# EAGLE schematic prototipo 1 v30 (EAGLE 9.7.0)
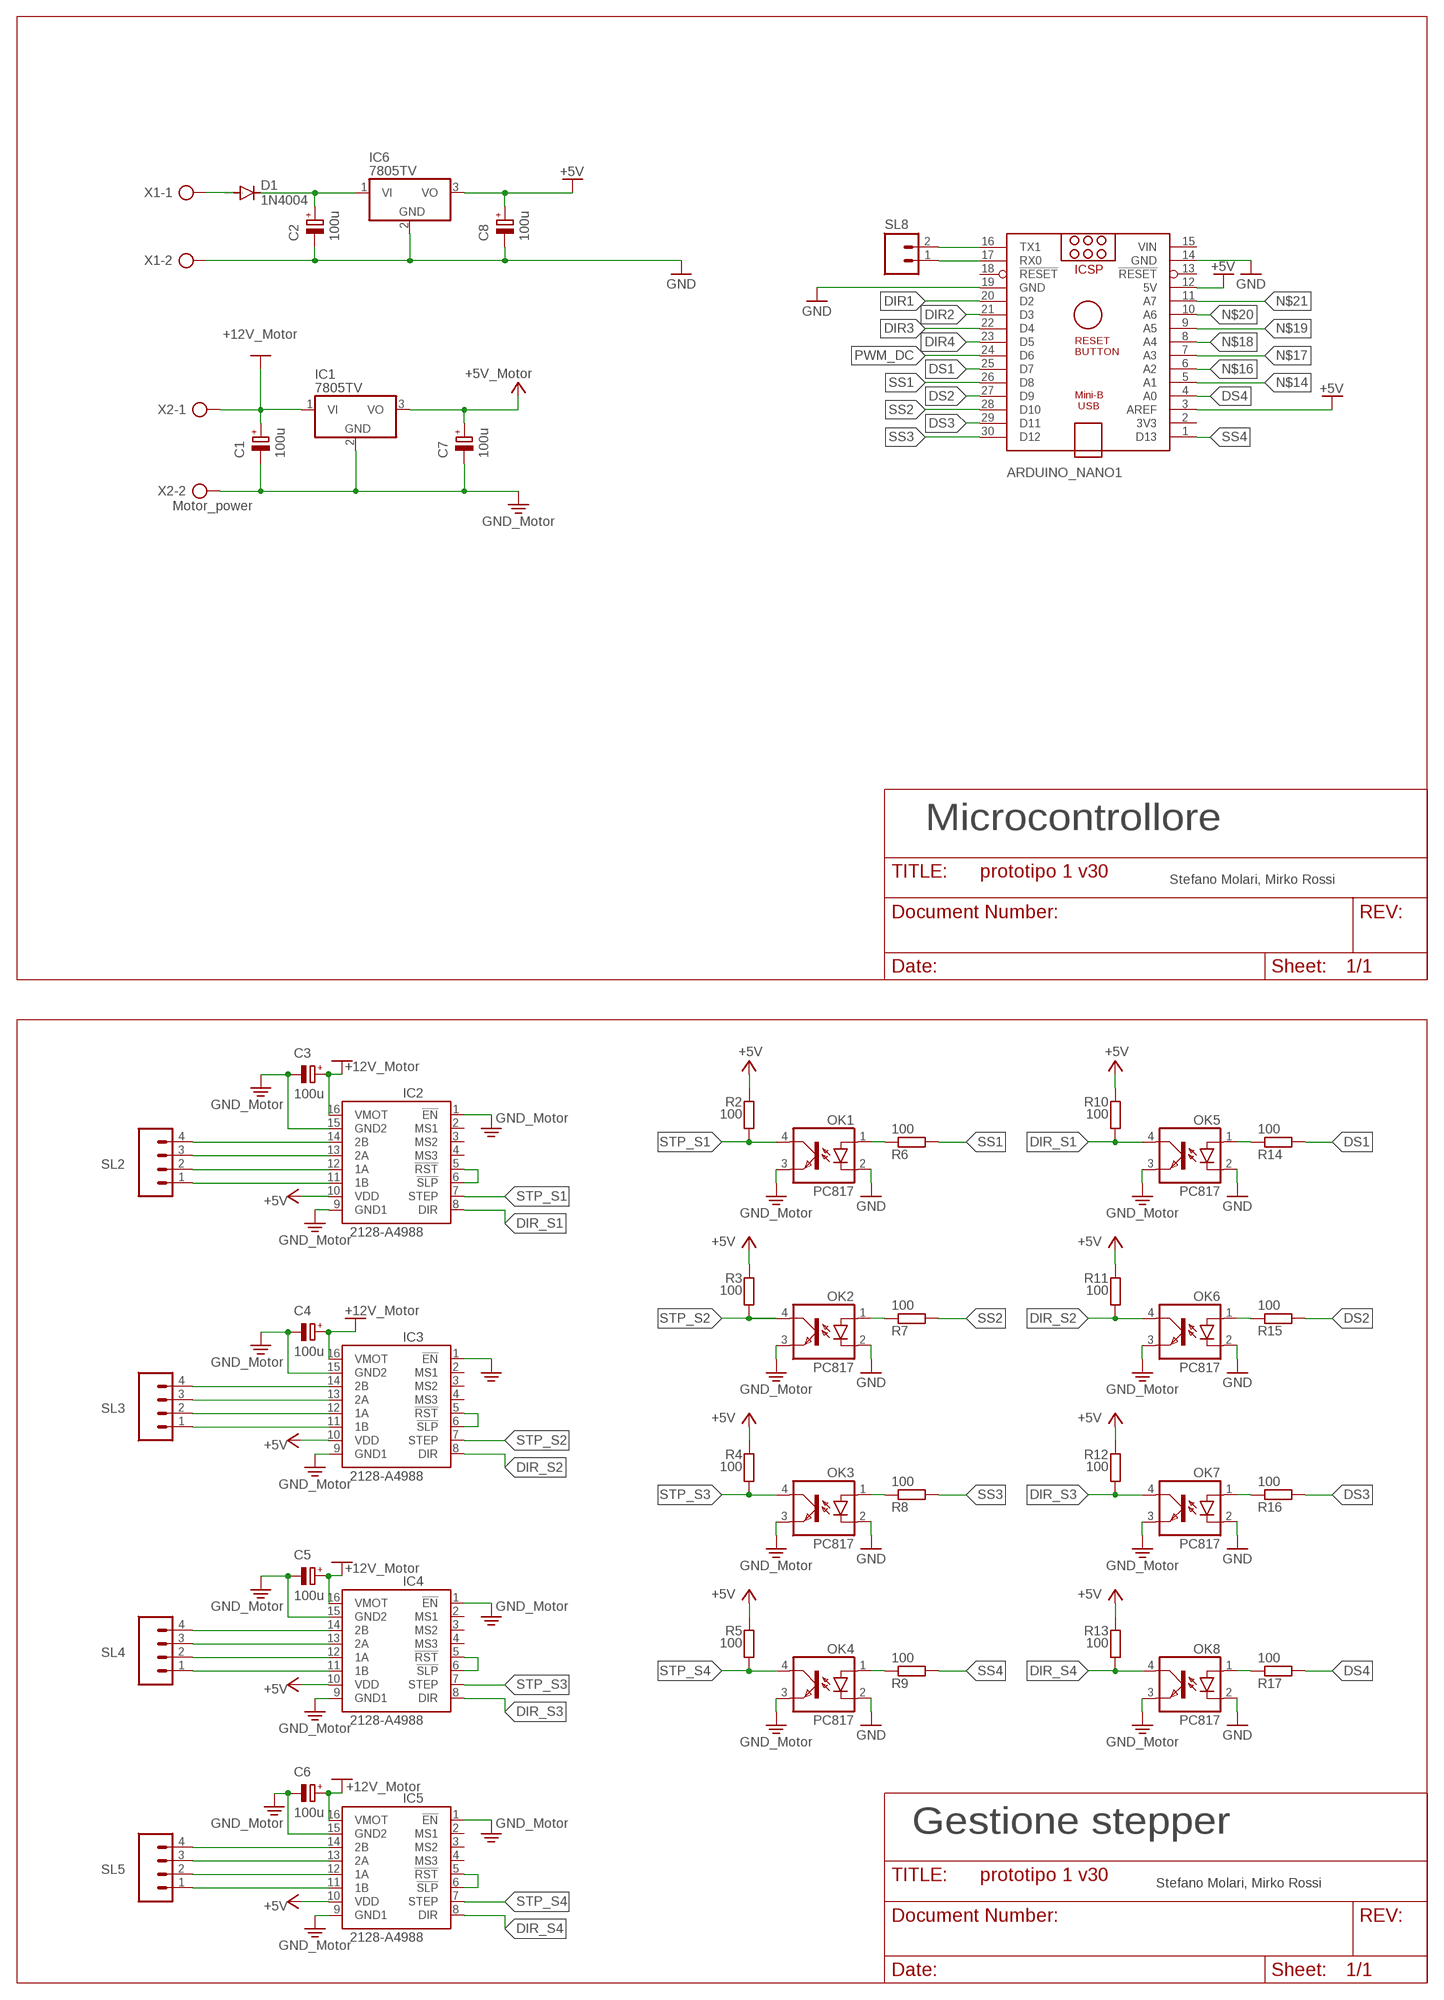
[diagram p0: schematic, sheet 1, part 1 of 2]
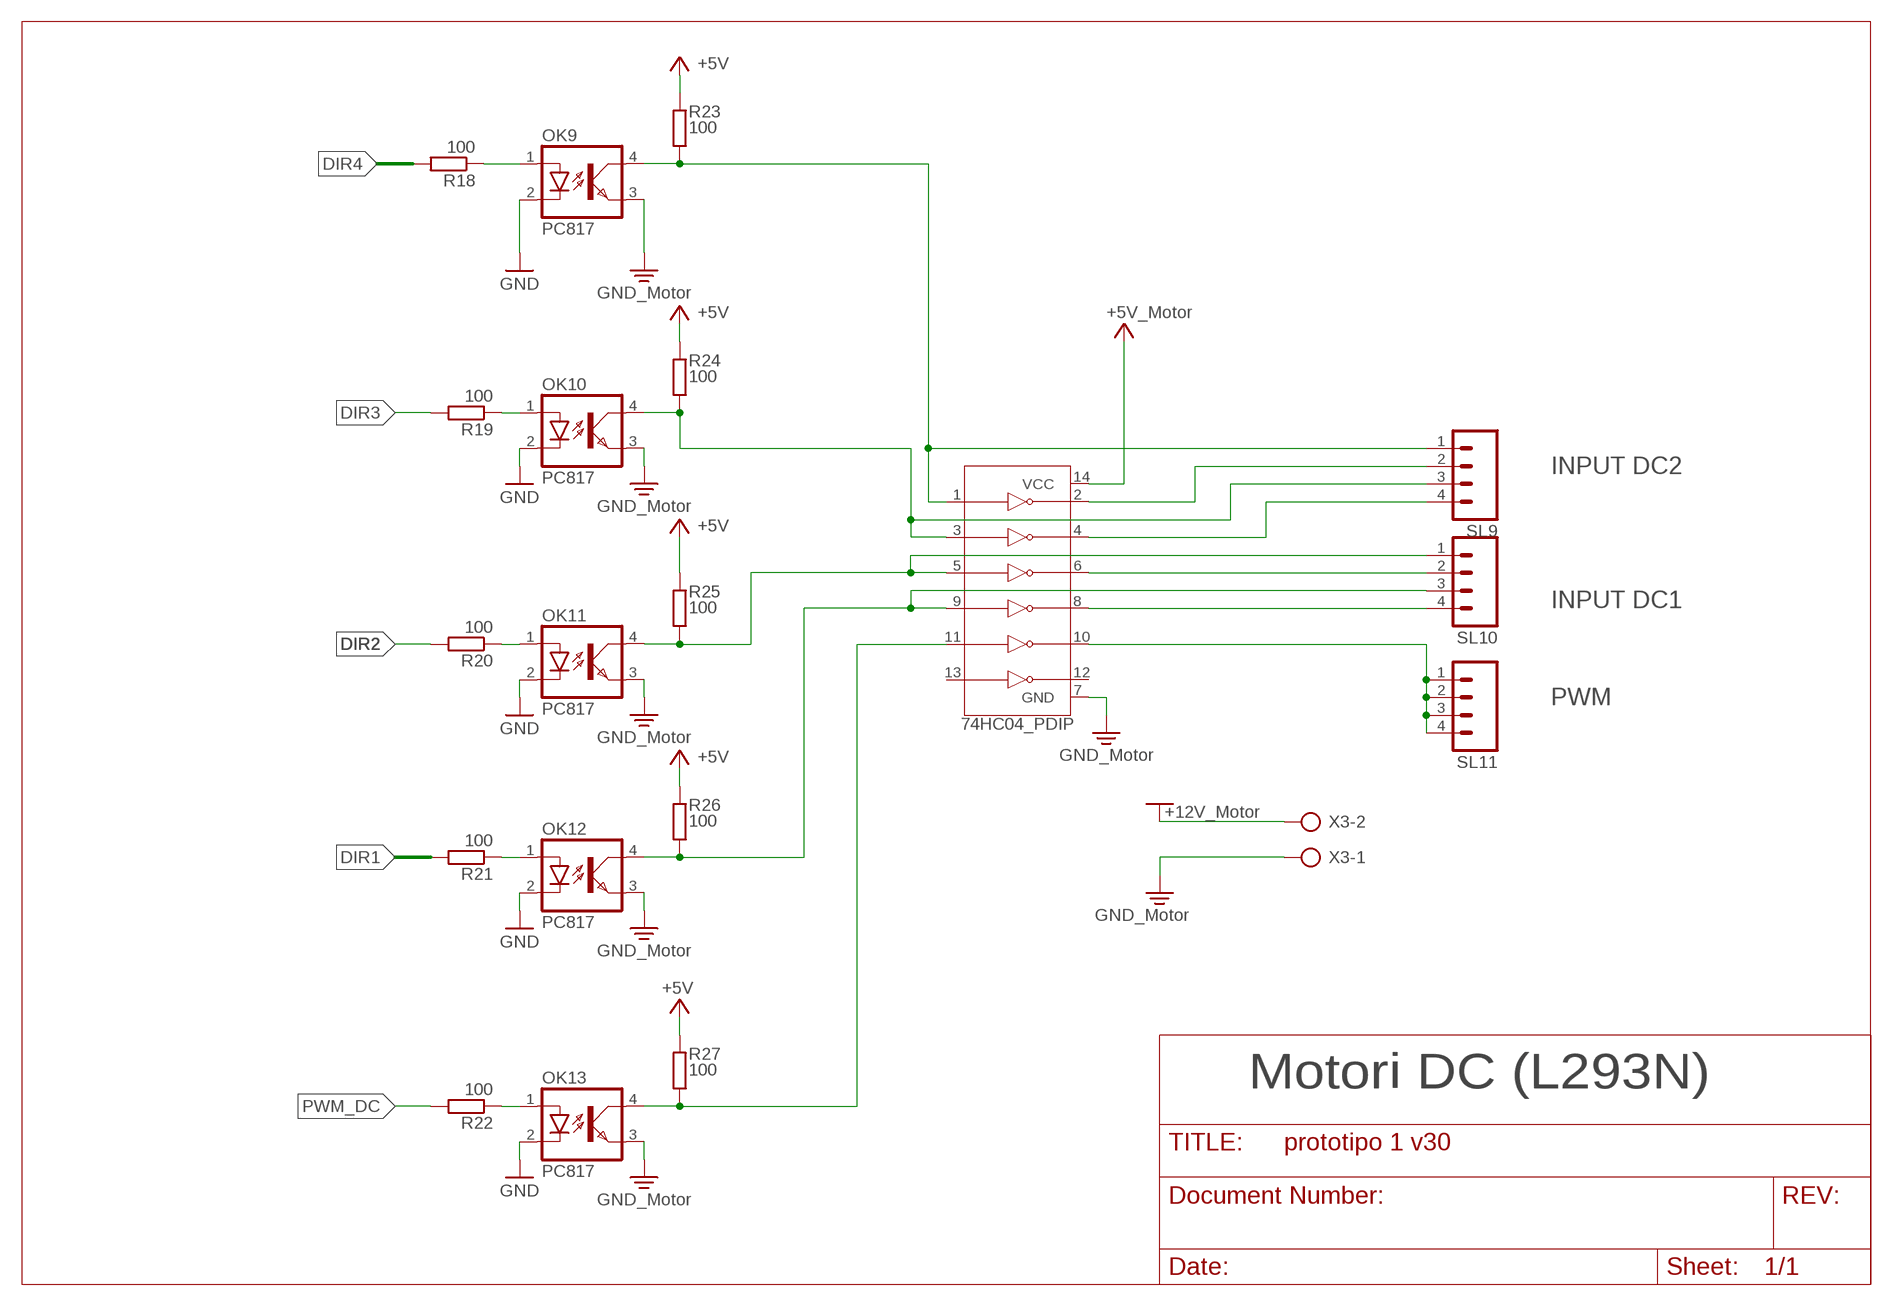
[diagram p1: schematic, sheet 1, part 2 of 2]

## Parts
ARDUINO_NANO1  ARDUINO_NANO  [ARDUINO_NANO]
C1  100u  CPOL-EUE2.5-5  [E2,5-5]
C2  100u  CPOL-EUE2.5-5  [E2,5-5]
C3  100u  CPOL-EUE2.5-5  [E2,5-5]
C4  100u  CPOL-EUE2.5-5  [E2,5-5]
C5  100u  CPOL-EUE2.5-5  [E2,5-5]
C6  100u  CPOL-EUE2.5-5  [E2,5-5]
C7  100u  CPOL-EUE2.5-5  [E2,5-5]
C8  100u  CPOL-EUE2.5-5  [E2,5-5]
D1  1N4004  [DO41-10]
IC1  7805TV  [TO220V]
IC2  2128-A4988  [A4988]
IC3  2128-A4988  [A4988]
IC4  2128-A4988  [A4988]
IC5  2128-A4988  [A4988]
IC6  7805TV  [TO220V]
IC7  74HC04_PDIP  [DIP762W53P254L1969H508Q14B]
OK1  PC817  [DIL04]
OK2  PC817  [DIL04]
OK3  PC817  [DIL04]
OK4  PC817  [DIL04]
OK5  PC817  [DIL04]
OK6  PC817  [DIL04]
OK7  PC817  [DIL04]
OK8  PC817  [DIL04]
OK9  PC817  [DIL04]
OK10  PC817  [DIL04]
OK11  PC817  [DIL04]
OK12  PC817  [DIL04]
OK13  PC817  [DIL04]
R2  100  R-EU_R0805  [R0805]
R3  100  R-EU_R0805  [R0805]
R4  100  R-EU_R0805  [R0805]
R5  100  R-EU_R0805  [R0805]
R6  100  R-EU_R0805  [R0805]
R7  100  R-EU_R0805  [R0805]
R8  100  R-EU_R0805  [R0805]
R9  100  R-EU_R0805  [R0805]
R10  100  R-EU_R0805  [R0805]
R11  100  R-EU_R0805  [R0805]
R12  100  R-EU_R0805  [R0805]
R13  100  R-EU_R0805  [R0805]
R14  100  R-EU_R0805  [R0805]
R15  100  R-EU_R0805  [R0805]
R16  100  R-EU_R0805  [R0805]
R17  100  R-EU_R0805  [R0805]
R18  100  R-EU_R0805  [R0805]
R19  100  R-EU_R0805  [R0805]
R20  100  R-EU_R0805  [R0805]
R21  100  R-EU_R0805  [R0805]
R22  100  R-EU_R0805  [R0805]
R23  100  R-EU_R0805  [R0805]
R24  100  R-EU_R0805  [R0805]
R25  100  R-EU_R0805  [R0805]
R26  100  R-EU_R0805  [R0805]
R27  100  R-EU_R0805  [R0805]
SL2  M04  [04P]
SL3  M04  [04P]
SL4  M04  [04P]
SL5  M04  [04P]
SL8  M02  [02P]
SL9  M04  [04P]
SL10  M04  [04P]
SL11  M04  [04P]
X1  Power  AK500/2  [AK500/2]
X2  Motor_power  AK500/2  [AK500/2]
X3  AK500/2  [AK500/2]

## Nets
+5V: ARDUINO_NANO1.3(AREF) ARDUINO_NANO1.12(5V) C7.+ C8.+ IC1.3(VO) IC2.10(VDD) IC3.10(VDD) IC4.10(VDD) IC5.10(VDD) IC6.3(VO) IC7.14(VCC) R2.2 R3.2 R4.2 R5.2 R10.2 R11.2 R12.2 R13.2 R23.2 R24.2 R25.2 R26.2 R27.2 ; supply symbol labelled +5V_Motor
+12V: C1.+ C3.+ C4.+ C5.+ C6.+ IC1.1(VI) IC2.16(VMOT) IC3.16(VMOT) IC4.16(VMOT) IC5.16(VMOT) X2.1 X3.2 ; supply symbol labelled +12V_Motor
DIR1: ARDUINO_NANO1.20(D2) R21.2
DIR2: ARDUINO_NANO1.21(D3) R20.2
DIR3: ARDUINO_NANO1.22(D4) R19.2
DIR4: ARDUINO_NANO1.23(D5) R18.2
DIR_S1: IC2.8(DIR) OK5.4(COL) R10.1
DIR_S2: IC3.8(DIR) OK6.4(COL) R11.1
DIR_S3: IC4.8(DIR) OK7.4(COL) R12.1
DIR_S4: IC5.8(DIR) OK8.4(COL) R13.1
DS1: ARDUINO_NANO1.25(D7) R14.2
DS2: ARDUINO_NANO1.27(D9) R15.2
DS3: ARDUINO_NANO1.29(D11) R16.2
DS4: ARDUINO_NANO1.4(A0) R17.2
GND: ARDUINO_NANO1.14(GND) ARDUINO_NANO1.19(GND) C1.- C2.- C3.- C4.- C5.- C6.- C7.- C8.- IC1.2(GND) IC2.1(!EN) IC2.9(GND1) IC2.15(GND2) IC3.1(!EN) IC3.9(GND1) IC3.15(GND2) IC4.1(!EN) IC4.9(GND1) IC4.15(GND2) IC5.1(!EN) IC5.9(GND1) IC5.15(GND2) IC6.2(GND) IC7.7(GND) OK1.2(C) OK1.3(EMIT) OK2.2(C) OK2.3(EMIT) OK3.2(C) OK3.3(EMIT) OK4.2(C) OK4.3(EMIT) OK5.2(C) OK5.3(EMIT) OK6.2(C) OK6.3(EMIT) OK7.2(C) OK7.3(EMIT) OK8.2(C) OK8.3(EMIT) OK9.2(C) OK9.3(EMIT) OK10.2(C) OK10.3(EMIT) OK11.2(C) OK11.3(EMIT) OK12.2(C) OK12.3(EMIT) OK13.2(C) OK13.3(EMIT) X1.2 X2.2 X3.1 ; supply symbol labelled GND_Motor
N$1: IC2.5(!RST) IC2.6(!SLP)
N$2: IC3.5(!RST) IC3.6(!SLP)
N$3: IC4.5(!RST) IC4.6(!SLP)
N$4: IC5.5(!RST) IC5.6(!SLP)
N$5: IC7.2(1Y) SL9.2
N$6: IC7.4(2Y) SL9.4
N$7: IC7.6(3Y) SL10.2
N$8: OK1.1(A) R6.1
N$9: D1.A X1.1
N$10: ARDUINO_NANO1.16(TX1) SL8.2
N$11: ARDUINO_NANO1.17(RX0) SL8.1
N$12: IC7.8(4Y) SL10.4
N$13: IC7.11(5A) OK13.4(COL) R27.1
N$14: ARDUINO_NANO1.5(A1)
N$15: IC7.10(5Y) SL11.1 SL11.2 SL11.3 SL11.4
N$16: ARDUINO_NANO1.6(A2)
N$17: ARDUINO_NANO1.7(A3)
N$18: ARDUINO_NANO1.8(A4)
N$19: ARDUINO_NANO1.9(A5)
N$20: ARDUINO_NANO1.10(A6)
N$21: ARDUINO_NANO1.11(A7)
N$24: C2.+ D1.C IC6.1(VI)
N$29: IC2.11(1B) SL2.1
N$30: IC2.12(1A) SL2.2
N$31: IC2.13(2A) SL2.3
N$32: IC2.14(2B) SL2.4
N$33: IC3.11(1B) SL3.1
N$34: IC3.12(1A) SL3.2
N$35: IC3.13(2A) SL3.3
N$40: IC3.14(2B) SL3.4
N$41: IC5.11(1B) SL5.1
N$42: OK5.1(A) R14.1
N$43: OK2.1(A) R7.1
N$44: OK6.1(A) R15.1
N$45: OK3.1(A) R8.1
N$46: OK7.1(A) R16.1
N$47: OK4.1(A) R9.1
N$48: OK8.1(A) R17.1
N$49: IC5.12(1A) SL5.2
N$50: IC5.13(2A) SL5.3
N$51: IC5.14(2B) SL5.4
N$52: IC4.11(1B) SL4.1
N$53: IC4.12(1A) SL4.2
N$54: IC4.13(2A) SL4.3
N$55: IC4.14(2B) SL4.4
N$101: IC7.5(3A) OK11.4(COL) R25.1 SL10.1
N$102: IC7.1(1A) OK9.4(COL) R23.1 SL9.1
N$104: OK10.1(A) R19.1
N$105: OK13.1(A) R22.1
N$115: OK11.1(A) R20.1
N$118: IC7.9(4A) OK12.4(COL) R26.1 SL10.3
N$119: OK12.1(A) R21.1
N$123: OK9.1(A) R18.1
N$132: IC7.3(2A) OK10.4(COL) R24.1 SL9.3
PWM_DC: ARDUINO_NANO1.24(D6) R22.2
SS1: ARDUINO_NANO1.26(D8) R6.2
SS2: ARDUINO_NANO1.28(D10) R7.2
SS3: ARDUINO_NANO1.30(D12) R8.2
SS4: ARDUINO_NANO1.1(D13) R9.2
STP_S1: IC2.7(STEP) OK1.4(COL) R2.1
STP_S2: IC3.7(STEP) OK2.4(COL) R3.1
STP_S3: IC4.7(STEP) OK3.4(COL) R4.1
STP_S4: IC5.7(STEP) OK4.4(COL) R5.1
Unconnected: ARDUINO_NANO1.2(3V3) ARDUINO_NANO1.13(!RESET) ARDUINO_NANO1.18(!RESET) IC2.2(MS1) IC2.3(MS2) IC2.4(MS3) IC3.2(MS1) IC3.3(MS2) IC3.4(MS3) IC4.2(MS1) IC4.3(MS2) IC4.4(MS3) IC5.2(MS1) IC5.3(MS2) IC5.4(MS3) IC7.12(6Y) IC7.13(6A)

## Notes on the sheet
- Microcontrollore
- Stefano Molari, Mirko Rossi
- INPUT DC2
- INPUT DC1
- PWM
- Gestione stepper | Motori DC (L293N)
- Stefano Molari, Mirko Rossi

## Power pins joined to a net without a drawn wire
VIN: ARDUINO_NANO1.15(VIN)

## Library data of the parts
ARDUINO_NANO1 = ArduinoNanoV30:ARDUINO_NANO: Arduino Nano V3.0 Overview: The Arduino Nano is a small, complete, and breadboard-friendly board based on the ATmega328 (Arduino Nano 3.x) or ATmega168 (Arduino Nano 2.x). It has more or less the same functionality of the Arduino Duemilanove, but in a different package. It lacks only a DC power jack, and works with a Mini-B USB cable instead of a standard one. The Nano was designed and is being produced by Gravitech. Specifications: Microcontroller Atmel ATmega168 or ATmega328 Operating Voltage (logic level) 5 V Input Voltage (recommended) 7-12 V Input Voltage (limits) 6-20 V Digital I/O Pins 14 (of which 6 provide PWM output) Analog Input Pins 8 DC Current per I/O Pin 40 mA Flash Memory 16 KB (ATmega168) or 32 KB (ATmega328) of which 2 KB used by bootloader SRAM 1 KB (ATmega168) or 2 KB (ATmega328) EEPROM 512 bytes (ATmega168) or 1 KB (ATmega328) Clock Speed 16 MHz Dimensions 0.73" x 1.70" Length 45 mm Width 18 mm Weigth 5 g Power: The Arduino Nano can be powered via the Mini-B USB connection, 6-20V unregulated external power supply (pin 30), or 5V regulated external power supply (pin 27). The power source is automatically selected to the highest voltage source. Memory: The ATmega168 has 16 KB of flash memory for storing code (of which 2 KB is used for the bootloader); the ATmega328 has 32 KB, (also with 2 KB used for the bootloader). The ATmega168 has 1 KB of SRAM and 512 bytes of EEPROM (which can be read and written with the EEPROM library); the ATmega328 has 2 KB of SRAM and 1 KB of EEPROM. Input and Output: Each of the 14 digital pins on the Nano can be used as an input or output, using pinMode(), digitalWrite(), and digitalRead() functions. They operate at 5 volts. Each pin can provide or receive a maximum of 40 mA and has an internal pull-up resistor (disconnected by default) of 20-50 kOhms. In addition, some pins have specialized functions. Visit Arduino - ArduinoBoardNano <https://www.arduino.cc/en/Main/ArduinoBoardNano>
C1-C8 = rcl:CPOL-EU: POLARIZED CAPACITOR, European symbol; SPICEPREFIX: C
D1 = diode:1N4004: DIODE general purpose rectifier, 1 A
IC1 IC6 = linear:78*: Positive VOLTAGE REGULATOR Source: http://cache.national.com/ds/LM/LM78L05.pdf http://www.fairchildsemi.com/ds/LM/LM7805.pdf
IC2-IC5 = pololu-stepper-driver:2128-A4988: A4988 Stepper Motor Driver Carrier; Black Edition #2128 A4988 Stepper Motor Driver Carrier; Black Edition <https://www.pololu.com/product/2128> in Japan, Suzaku Lab. Ltd. <https://suzakugiken.jp/> #2128 A4988ステッピングモータドライバ Black Edition <https://szc.jp/po2128>
IC7 = IC_Logic:74HC04: Hex Inverters Reference Datasheet <https://www.ti.com/lit/ds/symlink/sn74hc04.pdf?ts=1637607731979&ref_url=https%253A%252F%252Fwww.google.com%252F>; CATEGORY: IC_Logic; DESCRIPTION: Hex Inverters; MANUFACTURER: Generic; MPN: Generic; SUB-CATEGORY: Inverter; TYPE: Hex
OK1-OK13 = optocoupler:PC817: SHARP OPTO COUPLER; MPN: PC817X4J000F; OC_FARNELL: 9707727; OC_NEWARK: 97K7059
R2-R27 = rcl:R-EU_: RESISTOR, European symbol; SPICEPREFIX: R
SL2-SL5 SL9-SL11 = con-amp-quick:M04: AMP QUICK CONNECTOR; OC_FARNELL: unknown; OC_NEWARK: unknown
SL8 = con-amp-quick:M02: AMP QUICK CONNECTOR; OC_FARNELL: unknown; OC_NEWARK: unknown
X1-X3 = con-ptr500:AK500/2: CONNECTOR; OC_FARNELL: unknown; OC_NEWARK: unknown